# EAGLE design sensehub (EAGLE 5.05)
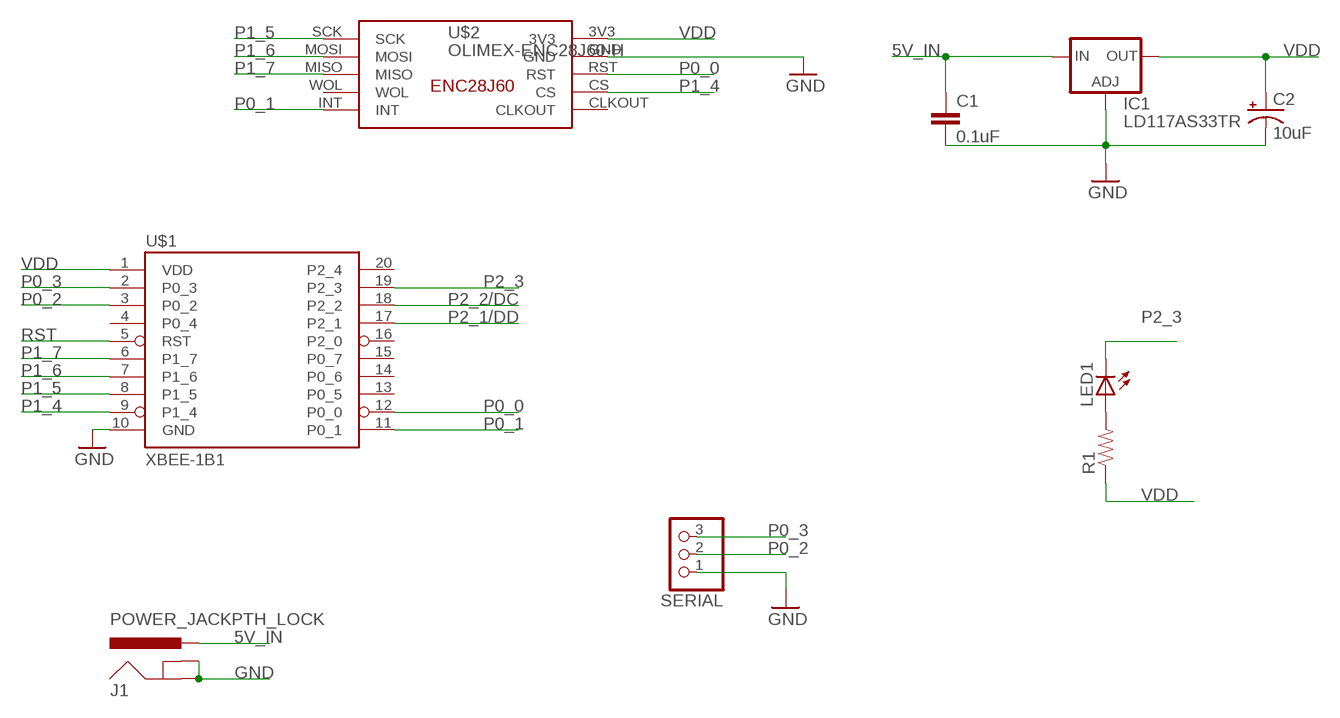
[diagram p0: schematic, sheet 1]

## Parts
C1  0.1uF  CAPPTH1  [CAP-PTH-5MM]
C2  10uF  CAP_POLPTH1  [CPOL-RADIAL-100UF-25V]
IC1  LD117AS33TR  [SOT223]
J1  POWER_JACKPTH_LOCK  [POWER_JACK_PTH_LOCK]
LED1  LED5MM  [LED5MM]
R1  RESISTORPTH1  [AXIAL-0.3]
SERIAL  PINHD-1X3  [1X03]
U$1  XBEE-1B1  [XBEE-1]
U$2  OLIMEX-ENC28J60-H  [OLIMEX-ENC28J60-H]

## Nets
5V_IN: C1.1 IC1.3(IN) J1.PWR
GND: C1.2 C2.2(-) IC1.1(ADJ) J1.GND J1.GNDBREAK SERIAL.1 U$1.10(GND) U$2.GND
N$1: LED1.A R1.P$2
P0_0: U$1.12(P0_0) U$2.RST
P0_1: U$1.11(P0_1) U$2.INT
P0_2: SERIAL.2 U$1.3(P0_2)
P0_3: SERIAL.3 U$1.2(P0_3)
P1_4: U$1.9(P1_4) U$2.CS
P1_5: U$1.8(P1_5) U$2.SCK
P1_6: U$1.7(P1_6) U$2.MOSI
P1_7: U$1.6(P1_7) U$2.MISO
P2_1/DD: U$1.17(P2_1)
P2_2/DC: U$1.18(P2_2)
P2_3: LED1.K(C) U$1.19(P2_3)
RST: U$1.5(RST)
VDD: C2.1(+) IC1.4(OUT) R1.P$1 U$1.1(VDD) U$2.3V3
Unconnected: U$1.4(P0_4) U$1.13(P0_5) U$1.14(P0_6) U$1.15(P0_7) U$1.16(P2_0) U$1.20(P2_4) U$2.CLKOUT U$2.WOL

## Library data of the parts
C1 = SparkFun:CAP: Capacitor Standard 0603 ceramic capacitor, and 0.1" leaded capacitor.
C2 = wsn:CAP_POL: Capacitor Polarized These are standard SMD and PTH capacitors. Normally 10uF, 47uF, and 100uF in electrolytic and tantalum varieties. Always verify the external diameter of the through hole cap, it varies with capacity, voltage, and manufacturer. The EIA devices should be standard.
IC1 = v-reg:LD117A?*: Low drop fixed and adjustable positive voltage regulators 1 A Source: http://www.st.com/stonline/products/literature/ds/7194/ld1117axx.pdf
J1 = wsn:POWER_JACK: Power Jack This is the standard 5.5mm barrel jack for power. The PTH is the most common, proven, reliable, footprint. All others are experimental. The Slot footprint only works if the mill layer is transmitted to the PCB fab house so be warned. Spark Fun Electronics SKU : PRT-00119. Mating wall wart : TOL-00298 (and others)
LED1 = SparkFun:LED: LEDs Standard schematic elements and footprints for 5mm, 3mm, 1206, and 0603 sized LEDs. 5mm - Spark Fun Electronics SKU : COM-00529 (and others)
R1 = SparkFun:RESISTOR: Resistor Basic schematic elements and footprints for 0603, 1206, and PTH 1/10th watt (small) resistors.
SERIAL = pinhead:PINHD-1X3: PIN HEADER
U$1 = wsn:XBEE-1
U$2 = wsn:OLIMEX-ENC28J60-H

## Board
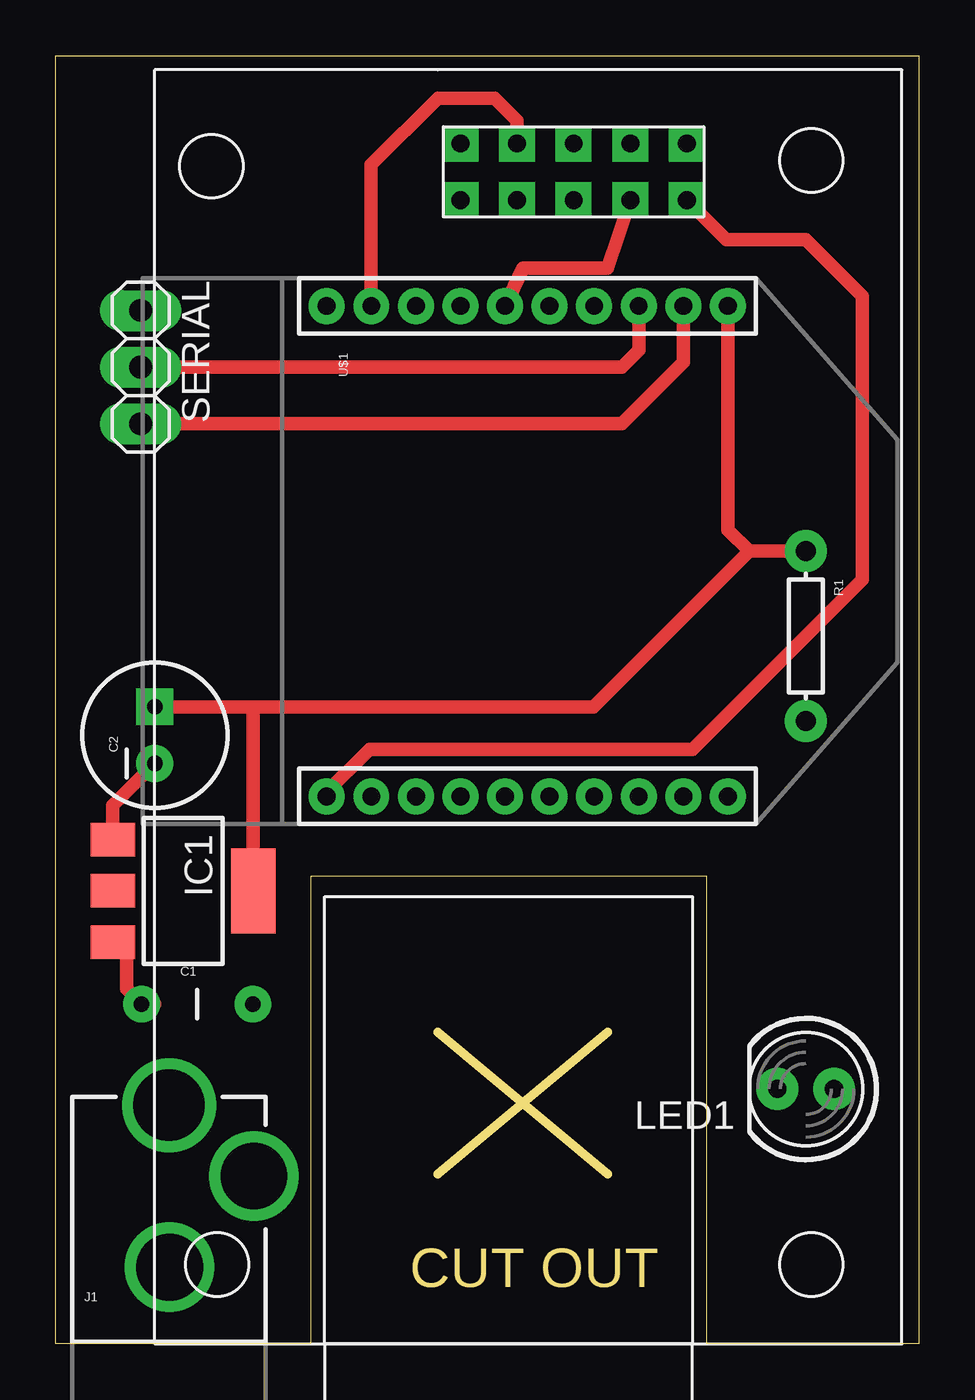
[diagram p1: board, top side]
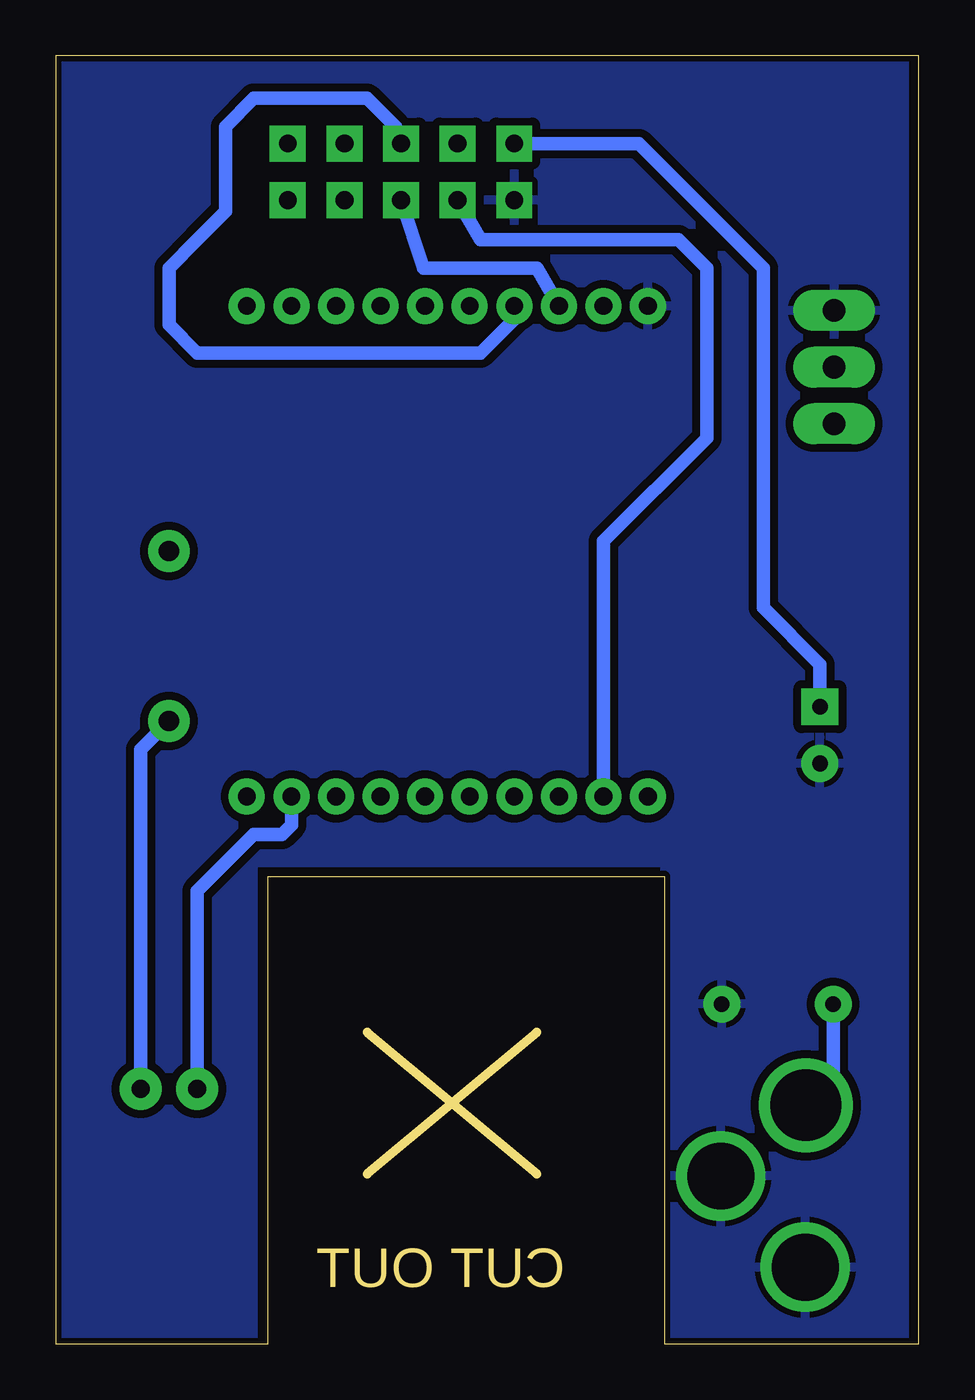
[diagram p2: board, bottom side, seen from below]

Size 38.73 x 57.79 mm. Coordinates in mm from the lower left corner, seen from the top.
Outline: 17.15,13.97 24.76,7.62
Outline: 24.76,13.97 17.15,7.62
Outline: 0,57.79 38.73,57.79 38.73,0 29.21,0 29.21,20.95 11.43,20.95 11.43,0 0,0 0,57.79
Copper layers (1*16): Top 0.035mm / dielectric 1.5mm / Bottom 0.035mm
Design rules "toby2 *": minimum track width 8mil, minimum drill 20mil, track to track 14mil, track to pad 14mil, pad to pad 10mil, via to via 10mil, smd to smd 10mil, copper to edge 10mil, drill to drill 8mil, minimum pad ring 16mil, minimum via ring 18mil, stop-mask expansion 4mil, vias tented up to drill 25mil, thermal gap 10mil

### Footprints (pad centres in the part's own frame; a part is rotated, then mirrored left to right if it is on the bottom)
CAP-PTH-5MM = drill 0.7 pad 1.651 round: 1 -2.5,0; 2 2.5,0
CPOL-RADIAL-100UF-25V = drill 0.7 pad 1.651 square: 1 1.27,0 | drill 0.7 pad 1.651 round: 2 -1.27,0
SOT223 = smd 1.5 x 2: 1 -2.3,-3.15; 2 0,-3.15; 3 2.3,-3.15 | smd 3.8 x 2: 4 0,3.15
POWER_JACK_PTH_LOCK = drill 2.997 round: GND 0.025,6.608; GNDBREAK 3.812,10.7 | drill 3.2 round: PWR 0,13.878
LED5MM = drill 0.813 pad 1.88 round: A -1.27,0; K 1.27,0
AXIAL-0.3 = drill 0.9 pad 1.88 round: P$1 -3.81,0; P$2 3.81,0
1X03 = drill 1.016 long: 1 -2.54,0; 2 0,0; 3 2.54,0
XBEE-1 = drill 0.8 pad 1.524 round: 1 -11,20; 2 -11,18; 3 -11,16; 4 -11,14; 5 -11,12; 6 -11,10; 7 -11,8; 8 -11,6; 9 -11,4; 10 -11,2; 11 11,2; 12 11,4; 13 11,6; 14 11,8; 15 11,10; 16 11,12; 17 11,14; 18 11,16; 19 11,18; 20 11,20
OLIMEX-ENC28J60-H = drill 0.8 square: 3V3 43.688,-2.286; CLKOUT 43.688,-12.446; CS 43.688,-4.826; GND 41.148,-2.286; INT 41.148,-12.446; MISO 41.148,-9.906; MOSI 43.688,-7.366; RST 41.148,-4.826; SCK 41.148,-7.366; WOL 43.688,-9.906

### Placement (x,y rotation side)
C1  6.35,15.24 0 top
C2  4.45,27.3 90 top
IC1  5.71,20.32 270 top
J1  5.08,-3.17 0 top
LED1  33.65,11.43 180 top
R1  33.65,31.75 270 top
SERIAL  3.81,43.82 270 top
U$1  10.16,35.56 270 top
U$2  15.87,10.16 90 top

### Tracks (layer width: path | path; a pad name or v marks a point on that pad's centre or on a via)
5V_IN
  Top 0.61: 4.45,15.24 C1.1 3.17,15.92 3.17,16.51 3.17,17.41 IC1.3
  Bottom 0.61: J1.PWR 3.85,11.93 C1.1
GND
  Top 0.61: IC1.1 2.56,24.16 C2.2 | J1.GNDBREAK 9.02,7.65
  pour Bottom: 38.73,59.06 38.73,0 29.84,0 29.84,21.59 11.43,21.59 11.43,0 0.63,0 0.63,59.06
N$1
  Bottom 0.61: R1.P$2 34.92,26.67 LED1.A
P0_0
  Bottom 0.61: U$2.RST 19.68,49.53 10.79,49.53 9.52,48.26 9.52,40.64 14.16,36.01 U$1.12
P0_1
  Top 0.61: U$1.11 12.06,24.66 14.08,26.67 23.49,26.67 28.57,26.67 36.2,34.29 36.2,46.99 33.65,49.53 30.1,49.53 U$2.INT
P0_2
  Top 0.61: U$1.3 26.16,44.58 25.4,43.82 SERIAL.2
P0_3
  Top 0.61: U$1.2 28.16,44.04 25.4,41.27 SERIAL.3
P1_4
  Top 0.61: U$1.9 14.16,52.9 17.15,55.88 19.68,55.88 20.7,54.86 U$2.CS
P1_5
  Bottom 0.61: U$1.8 17.15,48.26 22.23,48.26 U$2.SCK
P1_6
  Bottom 0.61: U$1.7 18.16,45.98 19.68,44.45 31.12,44.45 32.38,44.45 33.65,45.72 33.65,48.26 32.38,49.53 31.12,50.8 31.12,54.61 29.84,55.88 28.57,55.88 25.27,55.88 24.76,55.88 23.49,54.61 23.49,54.1 U$2.MOSI
P1_7
  Top 0.61: U$1.6 20.95,48.26 24.76,48.26 U$2.MISO
P2_3
  Bottom 0.61: LED1.K 32.38,20.32 29.84,22.86 28.57,22.86 28.16,23.27 U$1.19
VDD
  Top 0.61: 8.25,28.58 C2.1 | 8.25,28.58 24.13,28.58 31.12,35.56 | IC1.4 8.86,28.58 8.25,28.58 | U$1.1 30.16,39.05 30.16,36.52 31.12,35.56 | 31.12,35.56 R1.P$1
  Bottom 0.61: U$2.3V3 12.57,53.85 12.06,53.34 8.25,49.53 6.98,48.26 6.98,33.02 4.45,30.48 C2.1

### Text on the board
Dimension: CUT OUT